# EAGLE schematic sx1509-breakout_mount_remap3 (EAGLE 9.1.3)
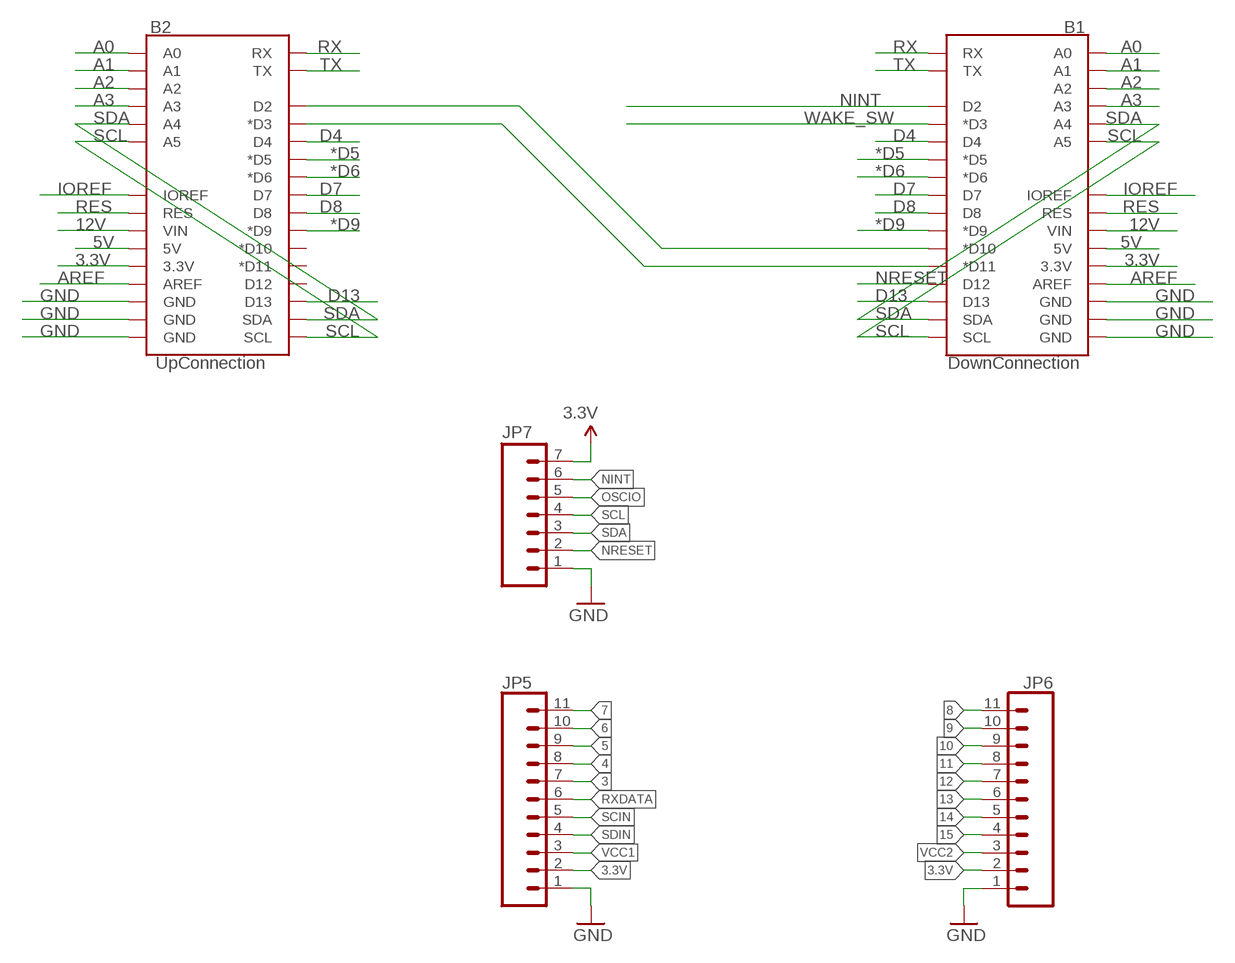
[diagram p0: schematic, sheet 1, part 1 of 2]
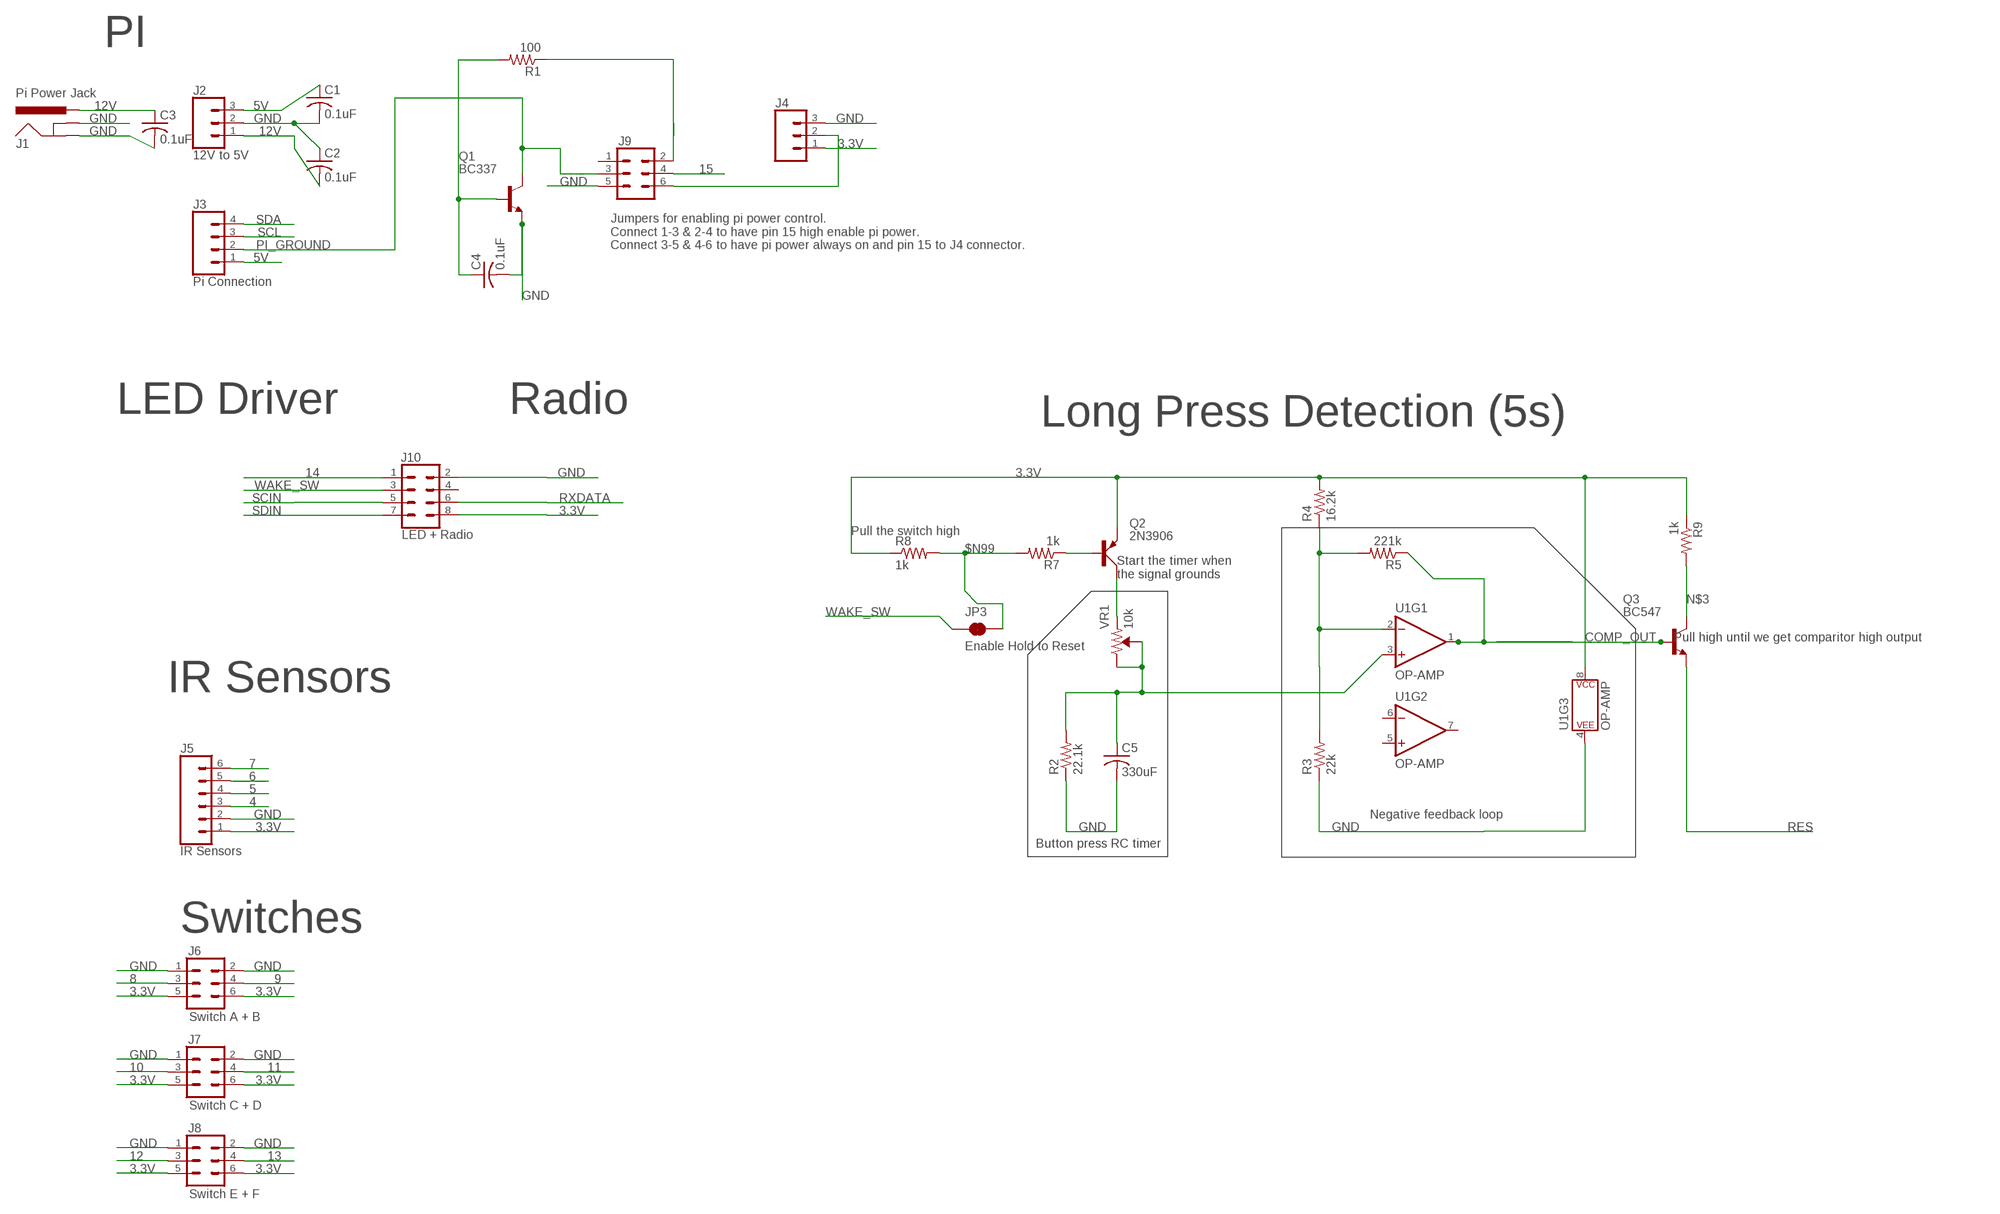
[diagram p1: schematic, sheet 1, part 2 of 2]

## Parts
B1  DownConnection  ARDUINO_UNO_R3_SHIELDNOLABELS  [UNO_R3_SHIELD_NOLABELS]
B2  UpConnection  ARDUINO_UNO_R3_SHIELDNOLABELS  [UNO_R3_SHIELD_NOLABELS]
C1  0.1uF  C-USC0805  [C0805]
C2  0.1uF  C-USC0805  [C0805]
C3  0.1uF  C-USC0805  [C0805]
C4  0.1uF  C-USC0805  [C0805]
C5  330uF  C-USC0805  [C0805]
J1  Pi Power Jack  POWER_JACKPTH_BREAD  [POWER_JACK_PTH_BREAD]
J2  12V to 5V  CONN_03  [1X03]
J3  Pi Connection  CONN_04  [1X04]
J4  CONN_03  [1X03]
J5  IR Sensors  CONN_06SILK_FEMALE_PTH  [1X06]
J6  Switch A + B  CONN_03X2FEMALE  [2X3]
J7  Switch C + D  CONN_03X2FEMALE  [2X3]
J8  Switch E + F  CONN_03X2FEMALE  [2X3]
J9  CONN_03X2NO_SILK  [2X3-NS]
J10  LED + Radio  CONN_04X2  [2X4]
JP3  Enable Hold to Reset  JUMPER-SMT_2_NC_TRACE_SILK  [SMT-JUMPER_2_NC_TRACE_SILK]
JP5  CONN_11  [1X11]
JP6  CONN_11  [1X11]
JP7  M07  [1X07]
Q1  BC337  [TO92]
Q2  2N3906  [TO92D]
Q3  BC547  [TO92]
R1  100  R-US_R0805  [R0805]
R2  22.1k  R-US_R0805  [R0805]
R3  22k  R-US_R0805  [R0805]
R4  16.2k  R-US_R0805  [R0805]
R5  221k  R-US_R0805  [R0805]
R7  1k  R-US_R0805  [R0805]
R8  1k  R-US_R0805  [R0805]
R9  1k  R-US_R0805  [R0805]
U1  OP-AMP  OPAMP-DUALU  [SO08]
VR1  10k  TRIMPOT-PTH-10MM-KNOB-1/2W-10%  [TRIMPOT-PTH-3386U]

## Nets
3: JP5.7
3.3V: B1.3.3V B2.3.3V J4.1 J5.1 J6.5 J6.6 J7.5 J7.6 J8.5 J8.6 J10.8 JP5.2 JP6.2 JP7.7 Q2.E R4.2 R8.1 R9.1 U1.8(P$V+)
4: J5.3 JP5.8
5: J5.4 JP5.9
5V: B1.5V B2.5V C1.1 J2.3 J3.1
6: J5.5 JP5.10
7: J5.6 JP5.11
8: J6.3 JP6.11
9: J6.4 JP6.10
10: J7.3 JP6.9
10_TO_2: B1.D10(*D10) B2.D2
11: J7.4 JP6.8
11_TO_3: B1.D11(*D11) B2.D3(*D3)
12: J8.3 JP6.7
12V: B1.VIN B2.VIN C2.2 C3.1 J1.PWR J2.1
13: J8.4 JP6.6
14: J10.1 JP6.5
15: J9.4 JP6.4
15_PLUG: J4.2 J9.6
$N99: JP3.2 R7.2 R8.2
*D5: B1.D5(*D5) B2.D5(*D5)
*D6: B1.D6(*D6) B2.D6(*D6)
*D9: B1.D9(*D9) B2.D9(*D9)
A0: B1.A0 B2.A0
A1: B1.A1 B2.A1
A2: B1.A2 B2.A2
A3: B1.A3 B2.A3
AREF: B1.AREF B2.AREF
COMP_OUT: Q3.2(B) R5.1 U1.1(OUT)
D4: B1.D4 B2.D4
D7: B1.D7 B2.D7
D8: B1.D8 B2.D8
D13: B1.D13 B2.D13
GND: B1.GND@0(GND) B1.GND@1(GND) B1.GND@2(GND) B2.GND@0(GND) B2.GND@1(GND) B2.GND@2(GND) C1.2 C2.1 C3.2 C4.2 C5.2 J1.GND J1.GNDBREAK J2.2 J4.3 J5.2 J6.1 J6.2 J7.1 J7.2 J8.1 J8.2 J9.5 J10.2 JP5.1 JP6.1 JP7.1 Q1.1(E) R2.1 R3.1 U1.4(P$V-)
IOREF: B1.IOREF B2.IOREF
N$1: Q2.B R7.1
N$2: C4.1 Q1.2(B) R1.2
N$3: Q3.3(C) R9.2
N$4: J9.2 R1.1
N$5: R3.2 R4.1 R5.2 U1.2(-IN)
N$7: Q2.C VR1.1(CCW)
N$8: C5.1 R2.2 U1.3(+IN) VR1.2(WIPER) VR1.3(CW)
NINT: B1.D2 JP7.6
NRESET: B1.D12 JP7.2
OSCIO: JP7.5
PI_GROUND: J3.2 J9.3 Q1.3(C)
RES: B1.RES B2.RES Q3.1(E)
RX: B1.RX B2.RX
RXDATA: J10.6 JP5.6
SCIN: J10.5 JP5.5
SCL: B1.A5 B1.SCL B2.A5 B2.SCL J3.3 JP7.4
SDA: B1.A4 B1.SDA B2.A4 B2.SDA J3.4 JP7.3
SDIN: J10.7 JP5.4
TX: B1.TX B2.TX
VCC1: JP5.3
VCC2: JP6.3
WAKE_SW: B1.D3(*D3) J10.3 JP3.1
Unconnected: B2.D10(*D10) B2.D11(*D11) B2.D12 J9.1 J10.4 U1.5(+IN) U1.6(-IN) U1.7(OUT)

## Notes on the sheet
- PI
- Jumpers for enabling pi power control.
  Connect 1-3 & 2-4 to have pin 15 high enable pi power.
  Connect 3-5 & 4-6 to have pi power always on and pin 15 to J4 connector.
- LED Driver | Radio | Long Press Detection (5s)
- Start the timer when
  the signal grounds
- IR Sensors
- Negative feedback loop
- Button press RC timer
- Switches

## Library data of the parts
B1 B2 = keir_library:ARDUINO_UNO_R3_SHIELD: Arduino R3 Shield Footprint Shield form compatible with the Arduino Uno R3. SparkFun Products: MG2639 Cellular Shield <https://www.sparkfun.com/products/13120> MIDI Shield <https://www.sparkfun.com/products/12898> R3 Stackable Headers Kit <https://www.sparkfun.com/products/11417>
C1-C5 = resistor:C-US: CAPACITOR, American symbol
J1 = SparkFun-Connectors:POWER_JACK: Power Jack Connector This is the standard 5.5mm barrel jack for power. The PTH is the most common, proven, reliable, footprint. The Slot footprint only works if the mill layer is transmitted to the PCB fab house so be warned. Here are the connectors we sell at SparkFun: DC Barrel Power Jack/Connector <https://www.sparkfun.com/products/119> (PRT-00119) DC Barrel Power Jack/Connector (SMD) <https://www.sparkfun.com/products/12748> (PRT-12748) DC Barrel Jack Adapter - Breadboard Compatible <https://www.sparkfun.com/products/10811> (PRT-10811) It is used on this SparkFun product (and many, many others): SparkFun RedBoard - Programmed with Arduino <https://www.sparkfun.com/products/12757> (DEV-12757) Also, if you need a mating power supply or connector, please check these out: Wall Adapter Power Supply - 9VDC 650mA <https://www.sparkfun.com/products/298> (TOL-00298) DC Barrel Jack Adapter - Male <https://www.sparkfun.com/products/10287> (PRT-10287); PROD_ID: PRT-10811
J2 J4 = SparkFun-Connectors:CONN_03: Multi connection point. Often used as Generic Header-pin footprint for 0.1 inch spaced/style header connections On any of the 0.1 inch spaced packages, you can populate with these: Break Away Headers - Straight <https://www.sparkfun.com/products/116> (PRT-00116) Break Away Male Headers - Right Angle <https://www.sparkfun.com/products/553> (PRT-00553) Female Headers <https://www.sparkfun.com/products/115> (PRT-00115) Break Away Headers - Machine Pin <https://www.sparkfun.com/products/117> (PRT-00117) Break Away Female Headers - Swiss Machine Pin <https://www.sparkfun.com/products/743> (PRT-00743) Stackable Header - 3 Pin (Female, 0.1") <https://www.sparkfun.com/products/13875> (PRT-13875) For SCREWTERMINALS and SPRING TERMINALS visit here: Screw Terimnals on SparkFun.com <https://www.sparkfun.com/search/results?term=Screw+Terminals> (5mm/3.5mm/2.54mm spacing) This device is also useful as a general connection point to wire up your design to another part of your project. Our various solder wires solder well into these plated through hole pads. Hook-Up Wire - Assortment (Stranded, 22 AWG) <https://www.sparkfun.com/products/11375> (PRT-11375) Hook-Up Wire - Assortment (Solid Core, 22 AWG) <https://www.sparkfun.com/products/11367> (PRT-11367) View the entire wire category on our website here <https://www.sparkfun.com/categories/141> Special notes: Molex polarized connector foot print use with SKU : PRT-08232 with associated crimp pins and housings.
J3 = SparkFun-Connectors:CONN_04: Multi connection point. Often used as Generic Header-pin footprint for 0.1 inch spaced/style header connections On any of the 0.1 inch spaced packages, you can populate with these: Break Away Headers - Straight <https://www.sparkfun.com/products/116> (PRT-00116) Break Away Male Headers - Right Angle <https://www.sparkfun.com/products/553> (PRT-00553) Female Headers <https://www.sparkfun.com/products/115> (PRT-00115) Break Away Headers - Machine Pin <https://www.sparkfun.com/products/117> (PRT-00117) Break Away Female Headers - Swiss Machine Pin <https://www.sparkfun.com/products/743> (PRT-00743) For SCREWTERMINALS and SPRING TERMINALS visit here: Screw Terimnals on SparkFun.com <https://www.sparkfun.com/search/results?term=Screw+Terminals> (5mm/3.5mm/2.54mm spacing) This device is also useful as a general connection point to wire up your design to another part of your project. Our various solder wires solder well into these plated through hole pads. Hook-Up Wire - Assortment (Stranded, 22 AWG) <https://www.sparkfun.com/products/11375> (PRT-11375) Hook-Up Wire - Assortment (Solid Core, 22 AWG) <https://www.sparkfun.com/products/11367> (PRT-11367) View the entire wire category on our website here <https://www.sparkfun.com/categories/141> Special notes: Molex polarized connector foot print use with SKU : PRT-08231 with associated crimp pins and housings. 1MM SMD Version SKU: PRT-10208; PROD_ID: CONN-09696
J5 = SparkFun-Connectors:CONN_06: Multi connection point. Often used as Generic Header-pin footprint for 0.1 inch spaced/style header connections On any of the 0.1 inch spaced packages, you can populate with these: Break Away Headers - Straight <https://www.sparkfun.com/products/116> (PRT-00116) Break Away Male Headers - Right Angle <https://www.sparkfun.com/products/553> (PRT-00553) Female Headers <https://www.sparkfun.com/products/115> (PRT-00115) Break Away Headers - Machine Pin <https://www.sparkfun.com/products/117> (PRT-00117) Break Away Female Headers - Swiss Machine Pin <https://www.sparkfun.com/products/743> (PRT-00743) Arduino Stackable Header - 6 Pin <https://www.sparkfun.com/products/9280> (PRT-09280) For SCREWTERMINALS and SPRING TERMINALS visit here: Screw Terimnals on SparkFun.com <https://www.sparkfun.com/search/results?term=Screw+Terminals> (5mm/3.5mm/2.54mm spacing) This device is also useful as a general connection point to wire up your design to another part of your project. Our various solder wires solder well into these plated through hole pads. Hook-Up Wire - Assortment (Stranded, 22 AWG) <https://www.sparkfun.com/products/11375> (PRT-11375) Hook-Up Wire - Assortment (Solid Core, 22 AWG) <https://www.sparkfun.com/products/11367> (PRT-11367) View the entire wire category on our website here <https://www.sparkfun.com/categories/141>; PROD_ID: CONN-08437
J6-J8 = SparkFun-Connectors:CONN_03X2: Multi connection point. Often used as Generic Header-pin footprint for 0.1 inch spaced/style header connections You can populate with any combo of single row headers, but if you'd like an exact match, check these: Header - 2x3 (Male, 0.1") <https://www.sparkfun.com/products/12807> (PRT-12807) Header - 2x3 (Female, 0.1") <https://www.sparkfun.com/products/13010> (PRT-13010) 2x3 Pin Shrouded Header <https://www.sparkfun.com/products/10877> (PRT-10877) On any of the 0.1 inch spaced packages, you can populate with these: Break Away Headers - Straight <https://www.sparkfun.com/products/116> (PRT-00116) Break Away Male Headers - Right Angle <https://www.sparkfun.com/products/553> (PRT-00553) Female Headers <https://www.sparkfun.com/products/115> (PRT-00115) Break Away Headers - Machine Pin <https://www.sparkfun.com/products/117> (PRT-00117) Break Away Female Headers - Swiss Machine Pin <https://www.sparkfun.com/products/743> (PRT-00743) Special note: the shrouded connector mates well with our 3x2 ribbon cables: Ribbon Crimp Connector - 6-pin (2x3, Female) <https://www.sparkfun.com/products/10651> (PRT-10651) Ribbon Cable - 6 wire (15ft) <https://www.sparkfun.com/products/10646> (PRT-10646); PROD_ID: CONN-11566; VALUE: FEMALE 2x3
J9 = SparkFun-Connectors:CONN_03X2: Multi connection point. Often used as Generic Header-pin footprint for 0.1 inch spaced/style header connections You can populate with any combo of single row headers, but if you'd like an exact match, check these: Header - 2x3 (Male, 0.1") <https://www.sparkfun.com/products/12807> (PRT-12807) Header - 2x3 (Female, 0.1") <https://www.sparkfun.com/products/13010> (PRT-13010) 2x3 Pin Shrouded Header <https://www.sparkfun.com/products/10877> (PRT-10877) On any of the 0.1 inch spaced packages, you can populate with these: Break Away Headers - Straight <https://www.sparkfun.com/products/116> (PRT-00116) Break Away Male Headers - Right Angle <https://www.sparkfun.com/products/553> (PRT-00553) Female Headers <https://www.sparkfun.com/products/115> (PRT-00115) Break Away Headers - Machine Pin <https://www.sparkfun.com/products/117> (PRT-00117) Break Away Female Headers - Swiss Machine Pin <https://www.sparkfun.com/products/743> (PRT-00743) Special note: the shrouded connector mates well with our 3x2 ribbon cables: Ribbon Crimp Connector - 6-pin (2x3, Female) <https://www.sparkfun.com/products/10651> (PRT-10651) Ribbon Cable - 6 wire (15ft) <https://www.sparkfun.com/products/10646> (PRT-10646)
J10 = SparkFun-Connectors:CONN_04X2: Multi connection point. Often used as Generic Header-pin footprint for 0.1 inch spaced/style header connections On any of the 0.1 inch spaced packages, you can populate with these: Break Away Headers - Straight <https://www.sparkfun.com/products/116> (PRT-00116) Break Away Male Headers - Right Angle <https://www.sparkfun.com/products/553> (PRT-00553) Female Headers <https://www.sparkfun.com/products/115> (PRT-00115) Break Away Headers - Machine Pin <https://www.sparkfun.com/products/117> (PRT-00117) Break Away Female Headers - Swiss Machine Pin <https://www.sparkfun.com/products/743> (PRT-00743)
JP3 = SparkFun-Jumpers:JUMPER-SMT_2_NC_TRACE: Normally closed trace jumper This jumper has a trace between two pads so it's normally closed (NC). Use a razor knife to open the connection. For best results follow the IPC guidelines for cutting traces: Cutout at least 0.063 mm (0.005 in). Remove all loose material to clean up the cut area. Seal the cut with an approved epoxy. Reapply solder to reclose the connection.
JP5 JP6 = SparkFun-Connectors:CONN_11: Multi connection point. Often used as Generic Header-pin footprint for 0.1 inch spaced/style header connections On any of the 0.1 inch spaced packages, you can populate with these: Break Away Headers - Straight <https://www.sparkfun.com/products/116> (PRT-00116) Break Away Male Headers - Right Angle <https://www.sparkfun.com/products/553> (PRT-00553) Female Headers <https://www.sparkfun.com/products/115> (PRT-00115) Break Away Headers - Machine Pin <https://www.sparkfun.com/products/117> (PRT-00117) Break Away Female Headers - Swiss Machine Pin <https://www.sparkfun.com/products/743> (PRT-00743) For SCREWTERMINALS and SPRING TERMINALS visit here: Screw Terimnals on SparkFun.com <https://www.sparkfun.com/search/results?term=Screw+Terminals> (5mm/3.5mm/2.54mm spacing) This device is also useful as a general connection point to wire up your design to another part of your project. Our various solder wires solder well into these plated through hole pads. Hook-Up Wire - Assortment (Stranded, 22 AWG) <https://www.sparkfun.com/products/11375> (PRT-11375) Hook-Up Wire - Assortment (Solid Core, 22 AWG) <https://www.sparkfun.com/products/11367> (PRT-11367) View the entire wire category on our website here <https://www.sparkfun.com/categories/141>
JP7 = SparkFun-Connectors:M07: Header 7 Standard 7-pin 0.1" header. Use with straight break away headers (SKU : PRT-00116), right angle break away headers (PRT-00553), swiss pins (PRT-00743), machine pins (PRT-00117), and female headers (PRT-00115). NOTES ON THE VARIANTS LOCK and LOCK_LONGPADS... This footprint was designed to help hold the alignment of a through-hole component (i.e. 7-pin header) while soldering it into place. You may notice that each hole has been shifted either up or down by 0.005 of an inch from it's more standard position (which is usually a perfectly straight line). This slight alteration caused the pins (the squares in the middle) to touch the edges of the holes. Because they are alternating, it causes a "brace" to hold the header in place. 0.005 has proven to be the perfect amount of "off-center" position when using our standard breakaway headers. Although looks a little odd when you look at the bare footprint, once you have a header in there, the alteration is very hard to notice. Also, if you push a header all the way into place, it is covered up entirely on the bottom side. This idea of altering the position of holes to aid alignment will be further integrated into the Sparkfun Library for other footprints. It can help hold any component with 3 or more connection pins.
Q1 = transistor-npn:BC337*: NPN Transistor
Q2 = transistor-small-signal:2N3906: PNP TRANSISTOR
Q3 = transistor-npn:BC547*: NPN Transistor; NOTE: Pull high until we get comparitor high output
R1-R5 R7 R9 = resistor:R-US_: RESISTOR, American symbol
R8 = resistor:R-US_: RESISTOR, American symbol; NOTE: Pull the switch high
U1 = SparkFun-IC-Amplifiers:OPAMP-DUAL: Generic op-amp footprint This component is for the standard 358 pinning of a dual op-amp From the LM358 datasheet: Pin 1: Output A Pin 2: Inverting Input A Pin 3: Non-Inverting Input A Pin 4: Gnd Pin 5: Non-Inverting Input B Pin 6: Inverting Input B Pin 7: Output B Pin 8: V+; PROD_ID: NA-XXXXX
VR1 = SparkFun-Resistors:TRIMPOT: Trimming Potentiometer (Trimpot) Three-terminal potentiometers, with an adjustable wiper and two adjustable resistors. A pot can be used to create a configurable voltage divider, or as a variable resistor. "Trimpots" are a subset of potentiometers, usually intended for "set-and-forget" applications. They're often more delicate than standard potentiometers - rated for fewer turns. Variants PTH-KNOB - PTH Trimpot w/ finger-adjustable knob Trimpot 10K with Knob <https://www.sparkfun.com/products/9806> (COM-09806) Datasheet <http://www.sparkfun.com/datasheets/Components/General/TSR-3386.pdf> SMD-3MM-CLOSED-FRAME - SMD 3mm Square Closed-Frame Trimpot Used on e.g. EasyDriver - Stepper Motor Driver <https://www.sparkfun.com/products/12779> Datasheet <http://www.bitechnologies.com/pdfs/22.pdf> (22AR10KTR) SMD-5MM - SMD 5mm Square Closed-Frame Trimpot Used on e.g. IOIO-OTG - V2.2 <https://www.sparkfun.com/products/13613> Datasheet <http://www.vishay.com/docs/51008/ts53.pdf> (TS53YL502MR10) SMD-3MM-1/10W-25% - 3mm Square Open-Frame Trimpot Used on e.g. SparkFun Shapeoko <https://www.sparkfun.com/products/13899> Datasheet <http://www.bourns.com/docs/Product-Datasheets/TC33.pdf> (TC33X-2-103E); PROD_ID: RES-09730; SF_SKU: COM-09806